# Altium schematic sheet KeyboardMainMCU.SchDoc
size A
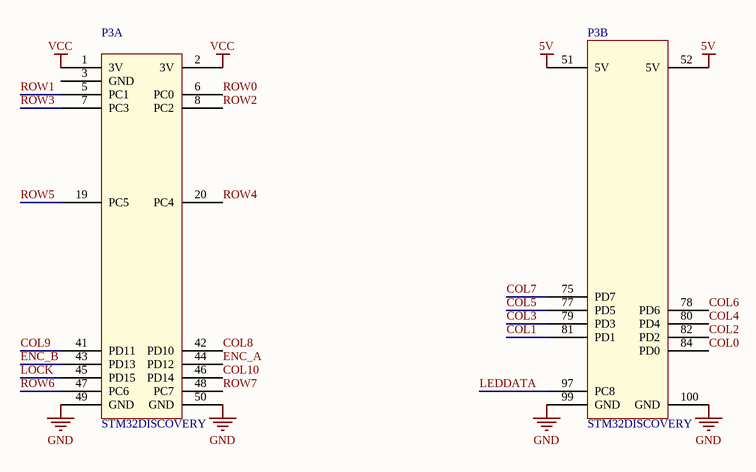
[diagram p0: KeyboardMainMCU.SchDoc]

## Parts
P3  STM32DISCOVERY  [DISCO]  (parts A,B of 2)

## Nets
5V: P3.51(5V) P3.52(5V)
GND: P3.49(GND) P3.50(GND) P3.99(GND) P3.100(GND)
VCC: P3.1(3V) P3.2(3V)
COL0: P3.84(PD0)
COL1: P3.81(PD1)
COL2: P3.82(PD2)
COL3: P3.79(PD3)
COL4: P3.80(PD4)
COL5: P3.77(PD5)
COL6: P3.78(PD6)
COL7: P3.75(PD7)
COL8: P3.42(PD10)
COL9: P3.41(PD11)
COL10: P3.46(PD14)
ENC_A: P3.44(PD12)
ENC_B: P3.43(PD13)
LEDDATA: P3.97(PC8)
LOCK: P3.45(PD15)
ROW0: P3.6(PC0)
ROW1: P3.5(PC1)
ROW2: P3.8(PC2)
ROW3: P3.7(PC3)
ROW4: P3.20(PC4)
ROW5: P3.19(PC5)
ROW6: P3.47(PC6)
ROW7: P3.48(PC7)

Not connected (* = marked no-connect by the designer): P3 3(GND)